# EAGLE design protoboardvusbportrev1 (EAGLE 5.06)
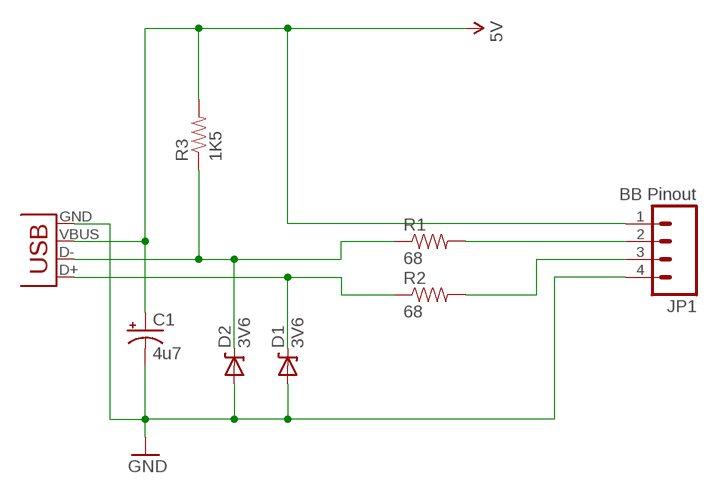
[diagram p0: schematic, sheet 1]

## Parts
C1  4u7  CAP_POLPTH2  [CPOL-RADIAL-10UF-25V]
D1  3V6  DIODE-ZENERPTH  [DIODE-ZENER]
D2  3V6  DIODE-ZENERPTH  [DIODE-ZENER]
JP1  BB Pinout  M04PTH  [1X04]
R1  68  RESISTORPTH1  [AXIAL-0.3]
R2  68  RESISTORPTH1  [AXIAL-0.3]
R3  1K5  RESISTORPTH1  [AXIAL-0.3]
X1  USBPTH  [USB-B-PTH]

## Nets
5V: C1.1(+) JP1.1 R3.P$2 X1.VBUS
GND: C1.2(-) D1.P$2(A) D2.P$2(A) JP1.4 X1.GND
N$1: D2.P$1(C) R1.P$1 R3.P$1 X1.D-
N$2: D1.P$1(C) R2.P$1 X1.D+
N$3: JP1.2 R1.P$2
N$4: JP1.3 R2.P$2

## Library data of the parts
C1 = SparkFun-2009-11-03:CAP_POL: Capacitor Polarized These are standard SMD and PTH capacitors. Normally 10uF, 47uF, and 100uF in electrolytic and tantalum varieties. Always verify the external diameter of the through hole cap, it varies with capacity, voltage, and manufacturer. The EIA devices should be standard.
D1 D2 = SparkFun-2009-11-03:DIODE-ZENER: Zener Diode Production Part - 8199 3.4V Zener Voltage
JP1 = SparkFun-2009-11-03:M04: Header 4 Standard 4-pin 0.1" header. Use with straight break away headers (SKU : PRT-00116), right angle break away headers (PRT-00553), swiss pins (PRT-00743), machine pins (PRT-00117), and female headers (PRT-00115). Molex polarized connector foot print use with SKU : PRT-08231 with associated crimp pins and housings.
R1-R3 = SparkFun-2009-11-03:RESISTOR: Resistor Basic schematic elements and footprints for 0603, 1206, and PTH 1/10th watt (small) resistors.
X1 = SparkFun-2009-11-03:USB: USB Connectors USB-B-PTH is fully proven SKU : PRT-00139 USB-miniB is fully proven SKU : PRT-00587 USB-A-PCB is untested. USB-A-H is throughly reviewed, but untested. Spark Fun Electronics SKU : PRT-00437 USB-B-SMT is throughly reviewed, but untested. Needs silkscreen touching up. USB-A-S has not been used/tested USB-MB-H has not been used/tested

## Board
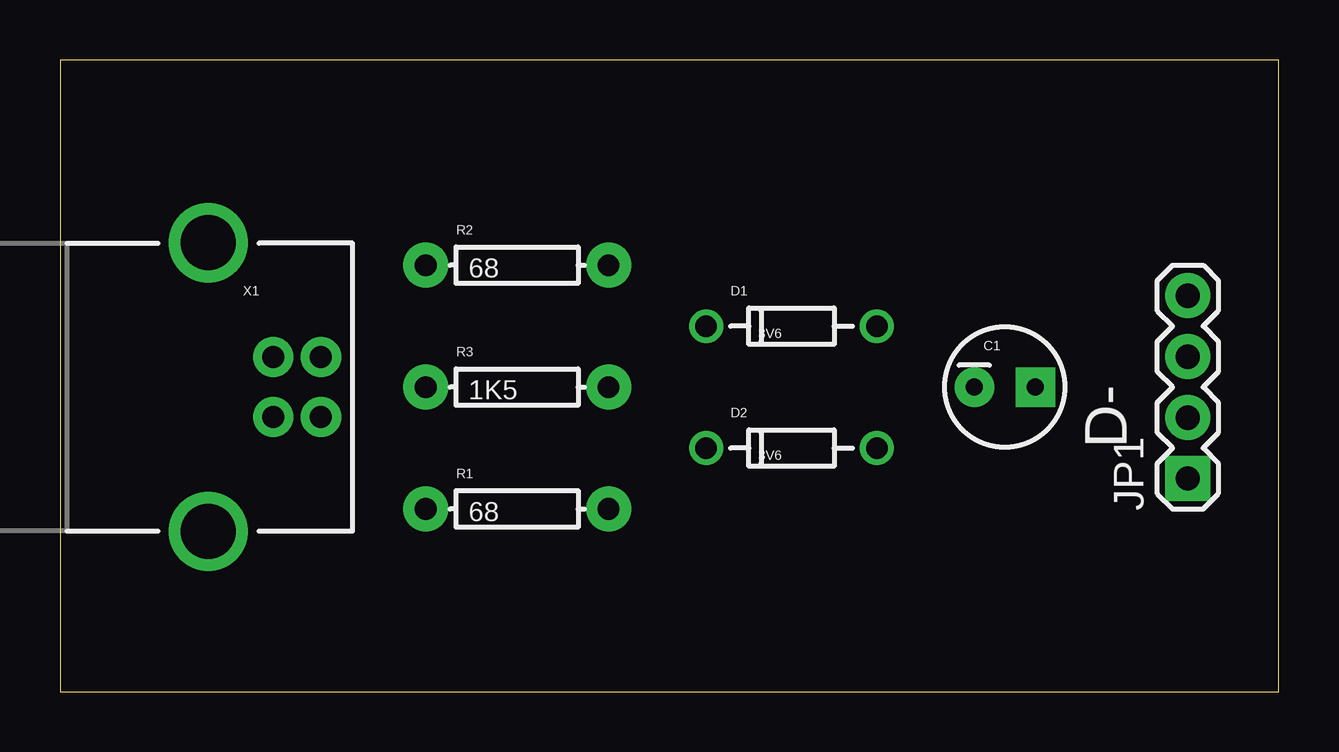
[diagram p1: board, top side]
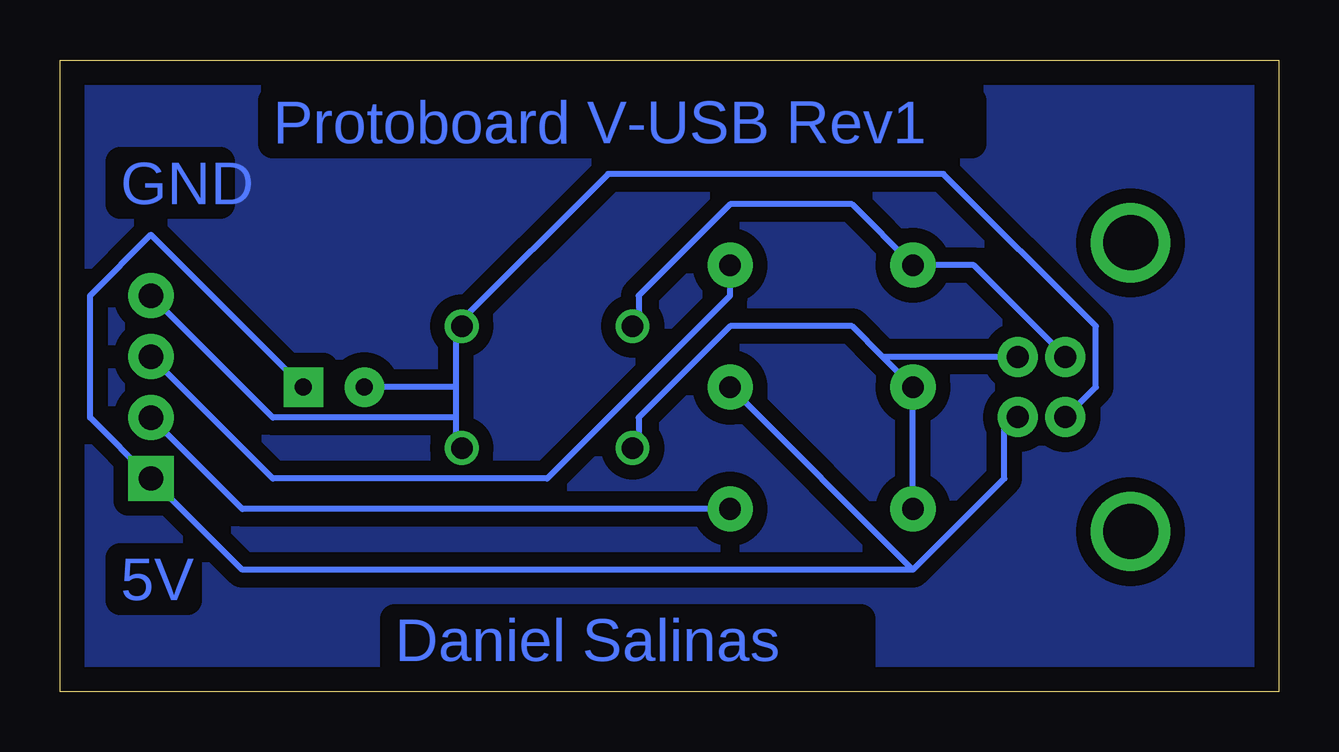
[diagram p2: board, bottom side, seen from below]

Size 50.78 x 26.34 mm. Coordinates in mm from the lower left corner, seen from the top.
Outline: 0,0 50.78,0 50.78,26.34 0,26.34 0,0
Copper layers (1*16): Top 0.035mm / dielectric 1.5mm / Bottom 0.035mm
Design rules "default *": minimum track width 10mil, minimum drill 24mil, track to track 10mil, track to pad 10mil, pad to pad 10mil, via to via 10mil, smd to smd 8mil, copper to edge 40mil, drill to drill 8mil, minimum pad ring 10mil, minimum via ring 8mil, stop-mask expansion 4mil, vias tented up to drill 0mil, thermal gap 10mil

### Footprints (pad centres in the part's own frame; a part is rotated, then mirrored left to right if it is on the bottom)
CPOL-RADIAL-10UF-25V = drill 0.7 pad 1.651 square: 1 1.27,0 | drill 0.7 pad 1.651 round: 2 -1.27,0
DIODE-ZENER = drill 0.9 round: P$1 -3.556,0; P$2 3.556,0
1X04 = drill 1.016 pad 1.88 square: 1 0,0 | drill 1.016 pad 1.88 round: 2 2.54,0; 3 5.08,0; 4 7.62,0
AXIAL-0.3 = drill 0.9 pad 1.88 round: P$1 -3.81,0; P$2 3.81,0
USB-B-PTH = drill 0.914 pad 1.676 round: D+ 0,1.25; D- 1.981,1.25; GND 0,-1.25; VBUS 1.981,-1.25 | drill 2.286 round: P$1 -2.718,-6.02; P$2 -2.718,6.02

### Placement (x,y rotation side)
C1  39.37,12.7 0 top
D1  30.48,15.24 0 top
D2  30.48,10.16 0 top
JP1  [1X04]  46.99,8.89 90 top
R1  19.05,7.62 0 top
R2  19.05,17.78 0 top
R3  19.05,12.7 0 top
X1  8.89,12.7 0 top

### Tracks (layer width: path | path; a pad name or v marks a point on that pad's centre or on a via)
5V
  Bottom 0.254: C1.1 46.99,19.05 49.53,16.51 49.53,11.43 JP1.1 43.18,5.08 15.24,5.08 | 15.24,5.08 11.43,8.89 11.43,11.43 X1.VBUS | 15.24,5.08 R3.P$2
GND
  Bottom 0.254: 34.29,15.24 34.29,12.7 | 34.29,12.7 34.29,11.43 | 34.29,11.43 34.29,10.16 D2.P$2 | 34.29,12.7 C1.2 | 34.29,15.24 27.94,21.59 13.97,21.59 7.62,15.24 7.62,12.7 8.89,11.43 X1.GND | 34.29,15.24 D1.P$2 | JP1.4 41.91,11.43 34.29,11.43
N$1
  Bottom 0.254: 16.51,13.97 R3.P$1 R1.P$1 | 16.51,13.97 17.78,15.24 22.86,15.24 26.67,11.43 26.67,10.16 D2.P$1 | 16.51,13.97 11.43,13.97 X1.D-
N$2
  Bottom 0.254: D1.P$1 26.67,15.24 26.67,16.51 22.86,20.32 17.78,20.32 R2.P$1 12.7,17.78 8.89,13.97 X1.D+
N$3
  Bottom 0.254: R1.P$2 43.18,7.62 JP1.2
N$4
  Bottom 0.254: JP1.3 41.91,8.89 30.48,8.89 22.86,16.51 R2.P$2
S$1
  pour Bottom (isolate 0.61): 0.64,26.04 50.16,26.04 50.16,0.63 0.64,0.63

### Text on the board
Bottom: Protoboard V-USB Rev1 | GND | 5V | Daniel Salinas
_tsilk: D-